# EasyEDA schematic FULL WAVE RECTIFIER PCB SCHEMATIC FABRICATION.json
TITLE: Sheet_1; REV: 1.0; Date: 2024-04-15; Sheet: 1/1; Drawn By: ab2397; Company: Your Company
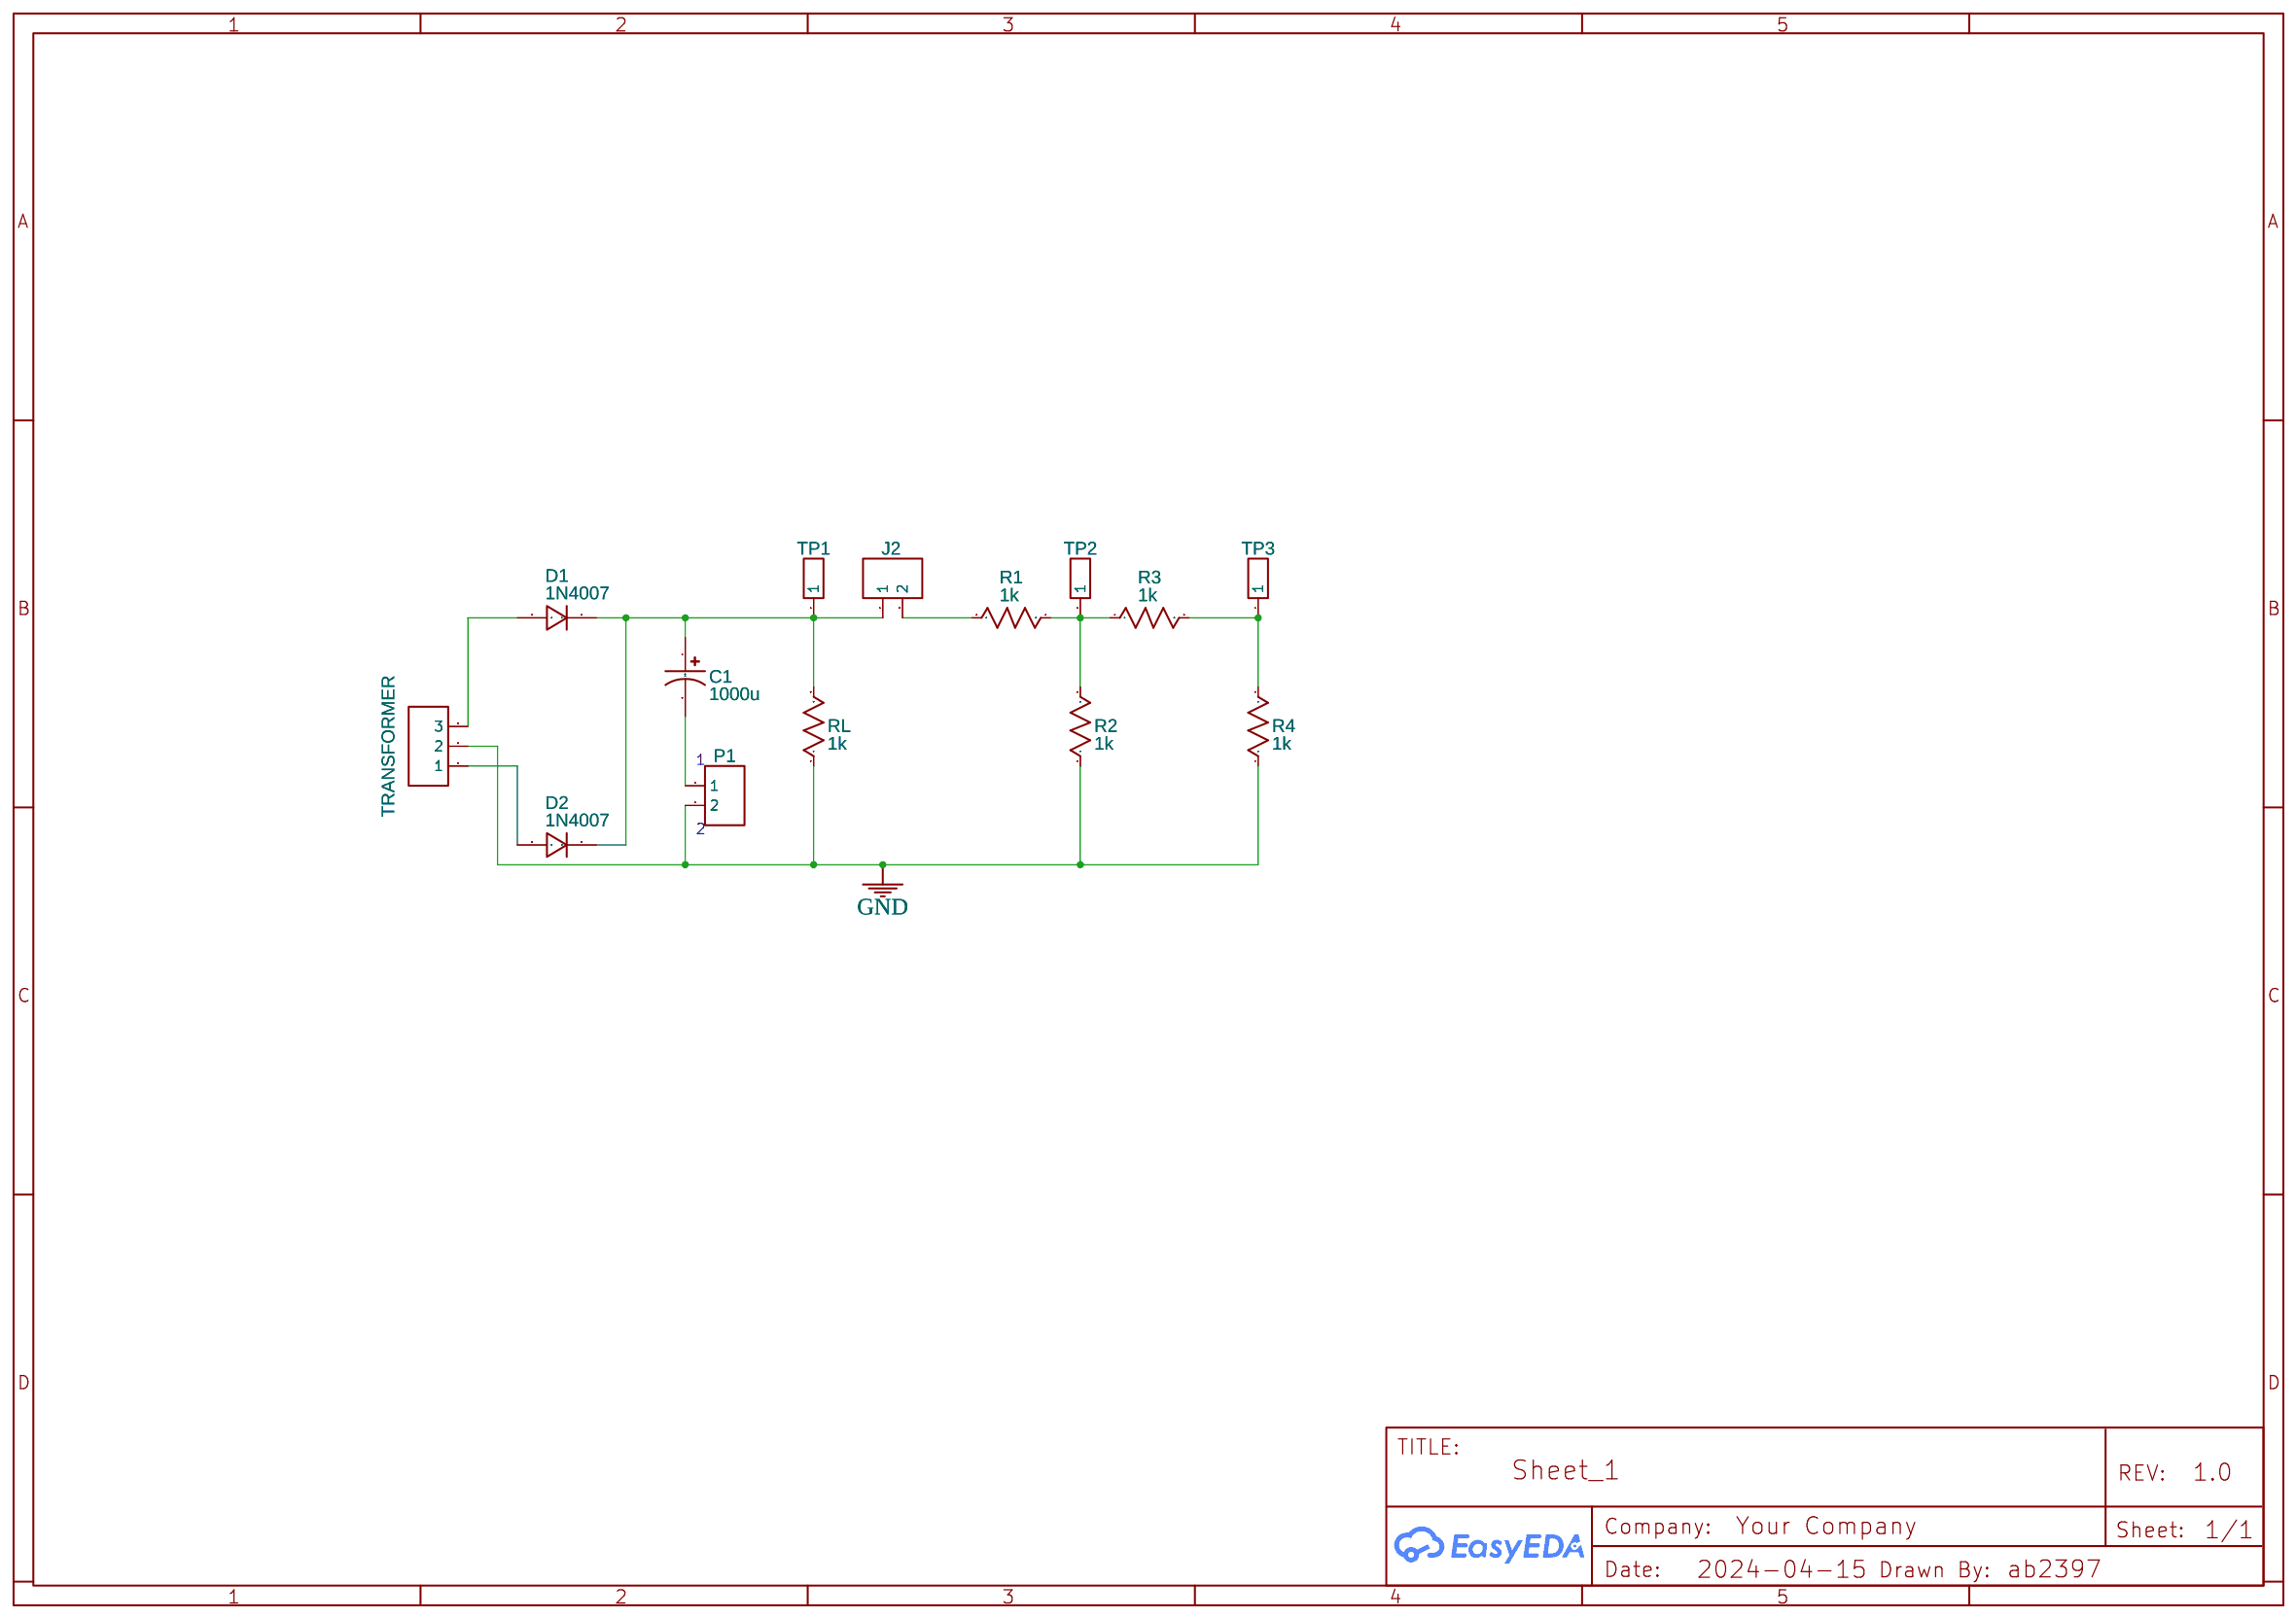
[diagram p0: schematic sheet]

## Parts
C1  1000u  [CAP-D3.0×F1.5]
D1  1N4007  [DO-41_BD2.4-L4.7-P8.70-D0.9-RD]
D2  1N4007  [DO-41_BD2.4-L4.7-P8.70-D0.9-RD]
J2  CONN-TH_2P-P5.00  [CONN-TH_2P-P5.00]
P1  CONN-TH_2P-P5.00  [CONN-TH_2P-P5.00]
R1  1k  [R_AXIAL-0.3]
R2  1k  [R_AXIAL-0.3]
R3  1k  [R_AXIAL-0.3]
R4  1k  [R_AXIAL-0.3]
RL  1k  [R_AXIAL-0.3]
TP1  HDR-M-2.54_1x1  [HDR-M-2.54_1X1]
TP2  HDR-M-2.54_1x1  [HDR-M-2.54_1X1]
TP3  HDR-M-2.54_1x1  [HDR-M-2.54_1X1]
TRANSFORMER  HDR-F-2.54_1x3  [HDR-F-2.54_1X3]

## Library data of the parts
C1 = CE_TH_D3.0×F1.5_US: Contributor: LCEDA_Lib
D1 D2 = 1N4007: Supplier: LCSC; Manufacturer: SEMTECH; Supplier Part: C106903; Contributor: LCEDA_Lib
J2 P1 = CONN-TH_2P-P5.00: Supplier: LCSC; Contributor: LCEDA_Lib
R1-R4 RL = R_AXIAL-0.3_US: Contributor: LCEDA_Lib
TP1-TP3 = HDR-M-2.54_1x1: Supplier Part: C81276; Supplier: LCSC; Contributor: LCEDA_Lib
TRANSFORMER = HDR-F-2.54_1x3: Supplier Part: C146690; Supplier: LCSC; Contributor: LCEDA_Lib

## Nets
GND: P1.2 R2.1 R4.1 RL.1 TRANSFORMER.2
Net-(C1-1): C1.1 D1.1 D2.1 J2.1 RL.2 TP1.1
Net-(C1-2): C1.2 P1.1
Net-(D1-2): D1.2 TRANSFORMER.3
Net-(D2-2): D2.2 TRANSFORMER.1
Net-(J2-2): J2.2 R1.1
Net-(R1-2): R1.2 R2.2 R3.1 TP2.1
Net-(R3-2): R3.2 R4.2 TP3.1

## Notes on the sheet
- 1
- 2
